# EAGLE design LegSensorBoard-Rev1 (EAGLE 9.5.1)
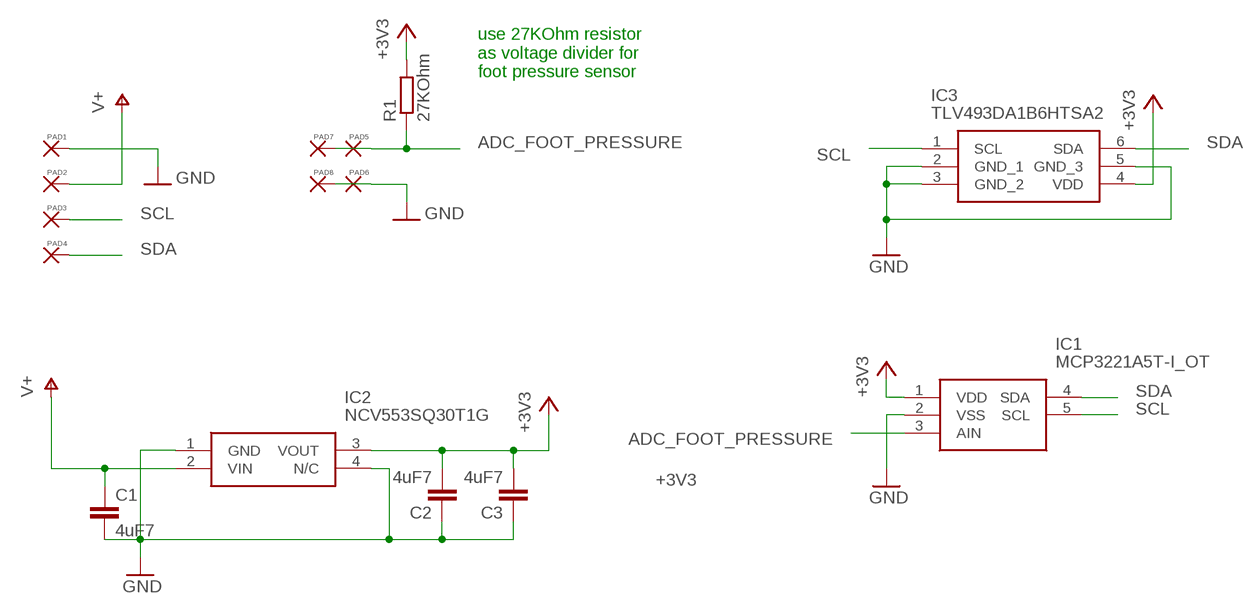
[diagram p0: schematic, sheet 1]

## Parts
C1  4uF7  C-EUC0402  [C0402]
C2  4uF7  C-EUC0402  [C0402]
C3  4uF7  C-EUC0402  [C0402]
IC1  MCP3221A5T-I_OT  [SOT95P270X145-5N]
IC2  NCV553SQ30T1G  [NCP563SQ18T1G]
IC3  TLV493DA1B6HTSA2  [SOT95P250X110-6N]
PAD1  SMD-PAD20X07  [SMD20X07]
PAD2  SMD-PAD20X07  [SMD20X07]
PAD3  SMD-PAD20X07  [SMD20X07]
PAD4  SMD-PAD20X07  [SMD20X07]
PAD5  SMD-PAD14X08  [SMD14X08]
PAD6  SMD-PAD14X08  [SMD14X08]
PAD7  SMD-PAD14X08  [SMD14X08]
PAD8  SMD-PAD14X08  [SMD14X08]
R1  27KOhm  R-EU_R0402  [R0402]

## Nets
+3V3: C2.2 C3.2 IC1.1(VDD) IC2.3(VOUT) IC3.4(VDD) R1.2
ADC_FOOT_PRESSURE: IC1.3(AIN) PAD5.1(P) PAD7.1(P) R1.1
GND: C1.2 C2.1 C3.1 IC1.2(VSS) IC2.1(GND) IC2.4(N/C) IC3.2(GND_1) IC3.3(GND_2) IC3.5(GND_3) PAD1.1(P) PAD6.1(P) PAD8.1(P)
SCL: IC1.5(SCL) IC3.1(SCL) PAD3.1(P)
SDA: IC1.4(SDA) IC3.6(SDA) PAD4.1(P)
V+: C1.1 IC2.2(VIN) PAD2.1(P)

## Notes on the sheet
- use 27KOhm resistor
  as voltage divider for
  foot pressure sensor

## Library data of the parts
C1-C3 = rcl:C-EU: CAPACITOR, European symbol; SPICEPREFIX: C
IC1 = HBPMouse:MCP3221A5T-I_OT: A/D Converter Source: Datasheet <http://www.mouser.com/datasheet/2/268/21732b-73984.pdf>; DESCRIPTION: A/D Converter; HEIGHT: mm; MANUFACTURER_NAME: Microchip; MANUFACTURER_PART_NUMBER: MCP3221A5T-I/OT; MOUSER_PART_NUMBER: 579-MCP3221A5T-I/OT; MOUSER_PRICE-STOCK: https://www.mouser.com/Search/Refine.aspx?Keyword=579-MCP3221A5T-I%2FOT
IC2 = HBPMouse:NCV553SQ30T1G: LDO Voltage Regulators LDO LINEAR REGULATOR Source: Datasheet <https://componentsearchengine.com/Datasheets/1/NCV553SQ30T1G.pdf>; DESCRIPTION: LDO Voltage Regulators LDO LINEAR REGULATOR; HEIGHT: mm; MANUFACTURER_NAME: ON Semiconductor; MANUFACTURER_PART_NUMBER: NCV553SQ30T1G; MOUSER_PART_NUMBER: 863-NCV553SQ30T1G; MOUSER_PRICE-STOCK: https://www.mouser.com/Search/Refine.aspx?Keyword=863-NCV553SQ30T1G
IC3 = HBPMouse:TLV493DA1B6HTSA2: Board Mount Hall Effect / 3D Magnetic Sensor Source: Datasheet <https://componentsearchengine.com/Datasheets/1/TLV493DA1B6HTSA2.pdf>; DESCRIPTION: Board Mount Hall Effect / 3D Magnetic Sensor; HEIGHT: 1.1mm; MANUFACTURER_NAME: Infineon; MANUFACTURER_PART_NUMBER: TLV493DA1B6HTSA2; MOUSER_PART_NUMBER: 726-TLV493DA1B6HTSA2; MOUSER_PRICE-STOCK: https://www.mouser.com/Search/Refine.aspx?Keyword=726-TLV493DA1B6HTSA2
PAD1-PAD8 = HBPMouse:SMD-PAD: SMD PAD
R1 = rcl:R-EU_: RESISTOR, European symbol; SPICEPREFIX: R

## Board
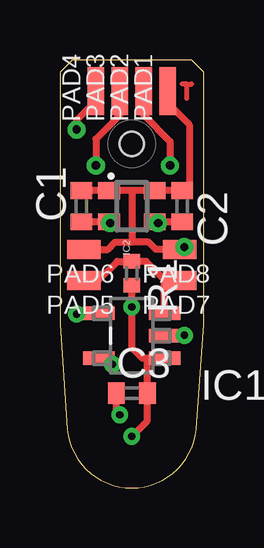
[diagram p1: board, top side]
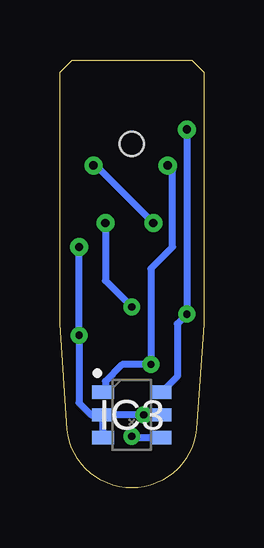
[diagram p2: board, bottom side, seen from below]

Size 6 x 17.85 mm. Coordinates in mm from the lower left corner, seen from the top.
Outline: 0.3,2.45 arc169 5.7,2.45 6,6.85 6,17.35 5.5,17.85 0.5,17.85 0,17.35 0,6.85 0.3,2.45
Copper layers (1*16): Top 0.035mm / dielectric 0.8mm / Bottom 0.035mm
Design rules "default *": minimum track width 0.15mm, minimum drill 0.3mm, track to track 0.15mm, track to pad 0.15mm, pad to pad 0.15mm, via to via 0.15mm, smd to smd 0mil, copper to edge 0.25mm, drill to drill 0.3mm, minimum pad ring 10mil, minimum via ring 8mil, stop-mask expansion 0.02mm, vias tented up to drill 0.5mm, thermal gap 10mil
Holes 1 mm at 3,14.35

### Footprints (pad centres in the part's own frame; a part is rotated, then mirrored left to right if it is on the bottom)
C0402 = smd 0.7 x 0.9: 1 -0.65,0; 2 0.65,0
SOT95P270X145-5N = smd 1.321 x 0.559: 1 -1.372,0.94; 2 -1.372,0; 3 -1.372,-0.94; 4 1.372,-0.94; 5 1.372,0.94
NCP563SQ18T1G = smd 0.7 x 0.9: 1 -0.65,-0.95; 2 0.65,-0.95; 3 0.65,0.95; 4 -0.65,0.95
SOT95P250X110-6N = smd 0.9 x 0.55: 1 -1.2,0.95; 2 -1.2,0; 3 -1.2,-0.95; 4 1.2,-0.95; 5 1.2,0; 6 1.2,0.95
SMD20X07 = smd 0.7 x 2: 1 0,0
SMD14X08 = smd 0.8 x 1.4: 1 0,0
R0402 = smd 0.6 x 0.7: 1 -0.5,0; 2 0.5,0

### Placement (x,y rotation side)
C1  0.9,11.75 90 top
C2  5.1,11.75 270 top
C3  3,3.95 0 top
IC1  3,6.35 180 top
IC2  3,11.75 270 top
IC3  3,3.05 0 bottom
PAD1  4.5,16.55 0 top
PAD2  3.5,16.55 0 top
PAD3  2.5,16.55 0 top
PAD4  1.5,16.55 0 top
PAD5  1,8.65 90 top
PAD6  1,9.95 90 top
PAD7  5,8.65 90 top
PAD8  5,9.95 90 top
R1  3,8.95 270 top

### Tracks (layer width: path | path; a pad name or v marks a point on that pad's centre or on a via)
+3V3  (via drill 0.3, 0.35)
  Top 0.3: IC1.1 3.7,5.41 | 3.7,5.41 3.44,5.41 3,5.85 v3,7.55 R1.2 | 3.7,5.41 3.65,5.36 C3.2 3.65,2.8 v3,2.15 | C2.2 IC2.3 4,11.05 v4.1,11.05
  Bottom 0.3: IC3.4 2.95,2.1 v3,2.15 | v3,7.55 4.1,8.65 v4.1,11.05
ADC_FOOT_PRESSURE
  Top 0.3: PAD5.1 1.6,8.65 2.4,9.45 R1.1 3.6,9.45 4.2,8.85 4.37,8.68 | PAD7.1 4.4,8.65 4.37,8.68 | IC1.3 4.37,8.68
GND  (via drill 0.3, 0.35)
  Top 0.3: v5.2,6.37 5.18,6.35 IC1.2 | C3.1 2.35,3.2 v2.5,3.05 | 3,12.4 IC2.4 C2.1 5.4,12.7 5.4,15.15 4.5,16.05 PAD1.1 | 3,12.4 IC2.1 C1.2 | v5.2,10.05 5.1,9.95 PAD8.1 4,9.95 3.7,10.25 3,10.25 | PAD6.1 2,9.95 2.3,10.25 3,10.25 | 3,12.4 3,10.25
  Bottom 0.3: IC3.2 4.7,3.05 5.2,3.55 v5.2,6.37 v5.2,10.05 | IC3.3 IC3.2 | IC3.2 v2.5,3.05 IC3.5
N$1
  Top 0.2: 5.3,16.25 5.3,16.85 | 5.3,16.85 5.5,16.85 | 5.3,16.85 5.1,16.85
SCL  (via drill 0.3, 0.35)
  Top 0.3: IC1.5 1.94,5.41 v2.2,5.15 | PAD3.1 2.5,15.55 1.5,14.55 v1.5,13.45
  Bottom 0.3: IC3.1 4.1,4.1 4.1,4.45 3.4,5.15 v2.2,5.15 2.2,9.15 1.3,10.05 1.3,13.25 v1.5,13.45
SDA  (via drill 0.3, 0.35)
  Top 0.3: IC1.4 0.74,7.29 v0.7,7.25 | PAD4.1 1.5,16.15 0.7,15.35 v0.7,14.95
  Bottom 0.3: IC3.6 1.75,4 1.1,4.65 1.1,6.85 v0.7,7.25 v0.7,14.95
V+  (via drill 0.35)
  Top 0.3: C1.1 IC2.2 2.1,11.15 v2.1,11.05 | PAD2.1 3.5,15.55 4.6,14.45 v4.6,13.45
  Bottom 0.3: v2.1,11.05 4.5,13.45 v4.6,13.45